# EAGLE schematic adaptador_scart_v1_panelizado (EAGLE 7.2.0)
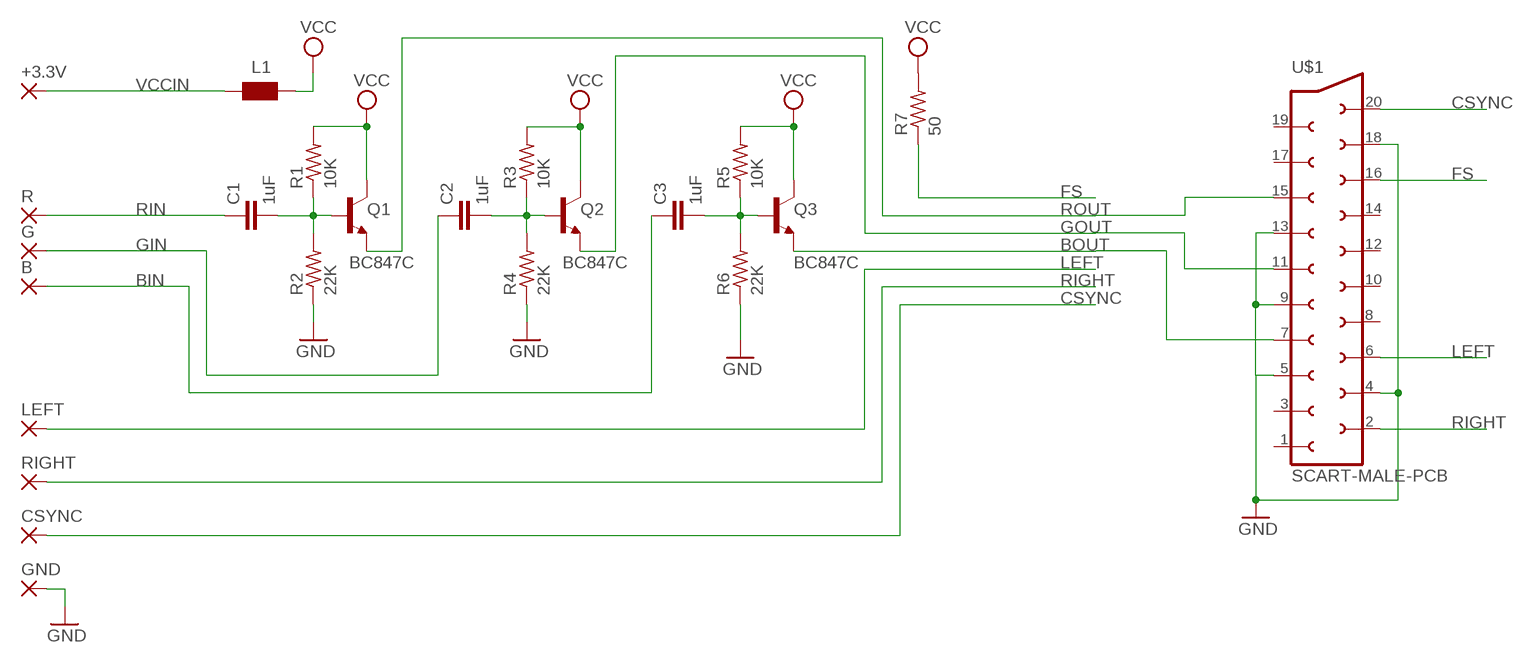
[diagram p0: schematic, sheet 1]

## Parts
+3.3V  SMD2  [SMD1,27-2,54]
B  SMD2  [SMD1,27-2,54]
C1  1uF  C-EUC1206K  [C1206K]
C2  1uF  C-EUC1206K  [C1206K]
C3  1uF  C-EUC1206K  [C1206K]
CSYNC  SMD2  [SMD1,27-2,54]
G  SMD2  [SMD1,27-2,54]
GND  SMD2  [SMD1,27-2,54]
L1  WE-CBF_0805  [0805]
LEFT  SMD2  [SMD1,27-2,54]
Q1  BC847C  BC847CSMD  [SOT23]
Q2  BC847C  BC847CSMD  [SOT23]
Q3  BC847C  BC847CSMD  [SOT23]
R  SMD2  [SMD1,27-2,54]
R1  10K  R-US_R0805  [R0805]
R2  22K  R-US_R0805  [R0805]
R3  10K  R-US_R0805  [R0805]
R4  22K  R-US_R0805  [R0805]
R5  10K  R-US_R0805  [R0805]
R6  22K  R-US_R0805  [R0805]
R7  50  R-US_R0805  [R0805]
RIGHT  SMD2  [SMD1,27-2,54]
U$1  SCART-MALE-PCB  [SCART-PCB]

## Nets
BIN: B.1(P) C3.1
BOUT: Q3.2(E) U$1.7
CSYNC: CSYNC.1(P) U$1.20
FS: R7.1 U$1.16
GIN: C2.1 G.1(P)
GND: GND.1(P) R2.1 R4.1 R6.1 U$1.4 U$1.5 U$1.9 U$1.13 U$1.18
GOUT: Q2.2(E) U$1.11
LEFT: LEFT.1(P) U$1.6
N$4: C1.2 Q1.1(B) R1.1 R2.2
N$8: C3.2 Q3.1(B) R5.1 R6.2
N$11: C2.2 Q2.1(B) R3.1 R4.2
RIGHT: RIGHT.1(P) U$1.2
RIN: C1.1 R.1(P)
ROUT: Q1.2(E) U$1.15
VCC: L1.2 Q1.3(C) Q2.3(C) Q3.3(C) R1.2 R3.2 R5.2 R7.2
VCCIN: +3.3V.1(P) L1.1
Unconnected: U$1.1 U$1.3 U$1.8 U$1.10 U$1.12 U$1.14 U$1.17 U$1.19

## Library data of the parts
+3.3V B CSYNC G GND LEFT R RIGHT = wirepad:SMD2: SMD PAD
C1-C3 = rcl:C-EU: CAPACITOR, European symbol
L1 = wuerth-elektronik:WE-CBF: SMD EMI Suppression Ferrite Beads - excellent anti-EMI properties - low DCR - impedances till 3000 ohms - rated current up to 6 A
Q1-Q3 = transistor-npn:BC847*: NPN Transistor
R1-R7 = adafruit:R-US_: RESISTOR, American symbol
U$1 = con-hirschmann:SCART-MALE-PCB